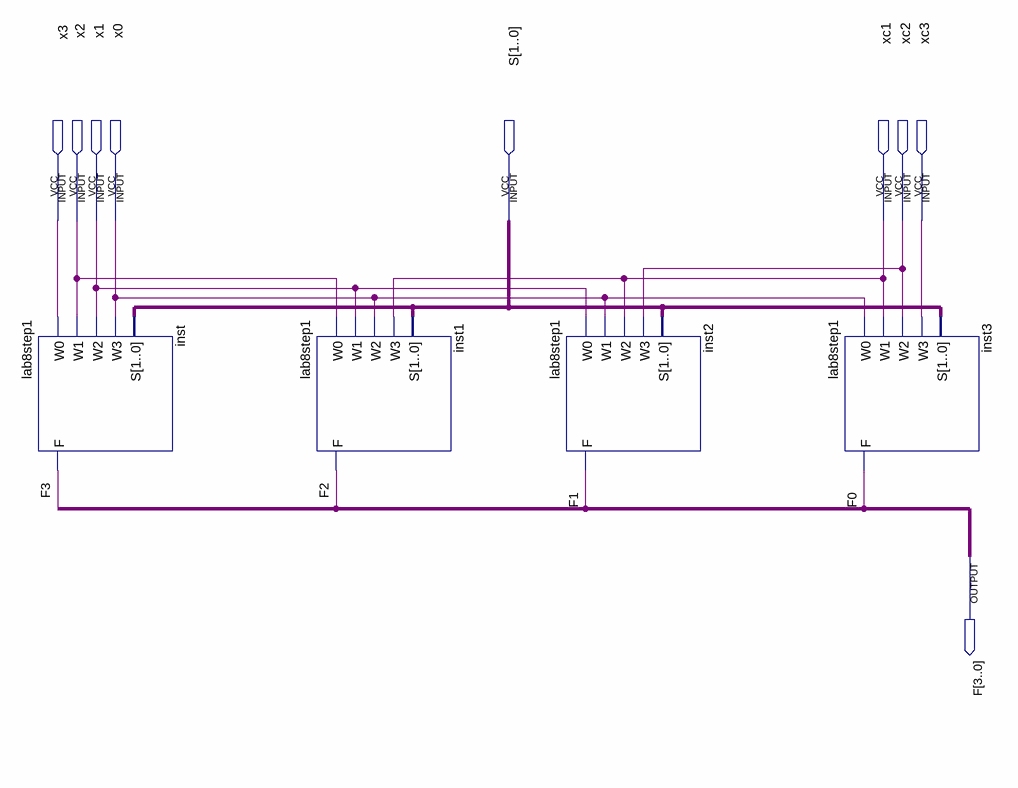
[diagram p0: schematic sheet]
// Quartus schematic lab8step2.bdf as structural Verilog: 4 symbols, 9 pins
module lab8step2 (
  input  x3,
  input  x2,
  input  x1,
  input  x0,
  input  [1:0] S,
  input  xc1,
  input  xc2,
  input  xc3,
  output [3:0] F
);

  lab8step1 inst (.W0(x3), .W1(x2), .W2(x1), .W3(x0), .S(S), .F(F[3]));
  lab8step1 inst1 (.W0(x2), .W1(x1), .W2(x0), .W3(xc1), .S(S), .F(F[2]));
  lab8step1 inst2 (.W0(x1), .W1(x0), .W2(xc1), .W3(xc2), .S(S), .F(F[1]));
  lab8step1 inst3 (.W0(x0), .W1(xc1), .W2(xc2), .W3(xc3), .S(S), .F(F[0]));
endmodule
